# Altium schematic sheet GTM_PowerCircuits.SchDoc
size A4
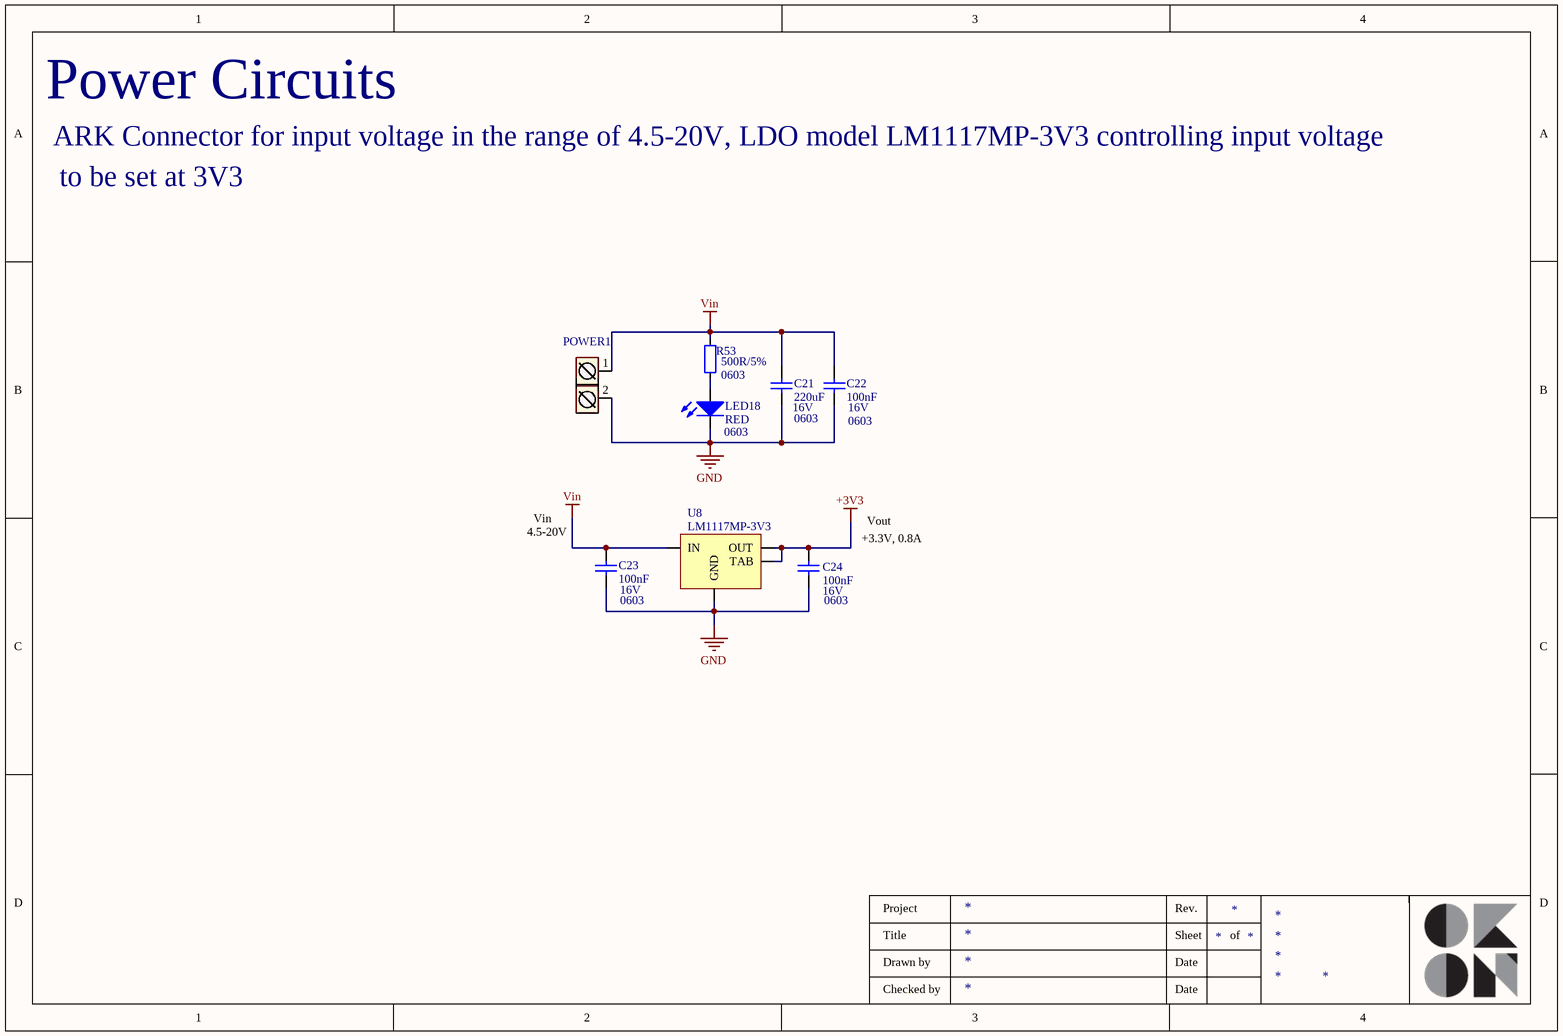
[diagram p0: GTM_PowerCircuits.SchDoc]

## Parts
C21  value 220uF  Package: 0603  Capacity: 16V  [0603_CAP]  (hidden comment: Cap)
C22  value 100nF  Package: 0603  Capacity: 16V  [0603_CAP]  (hidden comment: Cap)
C23  value 100nF  Package: 0603  Capacity: 16V  [0603_CAP]  (hidden comment: Cap)
C24  value 100nF  Package: 0603  Capacity: 16V  [0603_CAP]  (hidden comment: Cap)
LED18  RED  Package: 0603  [0603_led_red]
POWER1  ARK2  [ARK2]  (value not drawn)
R53  500R/5%  [0603]
U8  LM1117MP-3V3  [SOT223]

## Nets
+3V3: C24.1 U8.2(OUT) U8.4(TAB)
GND: C21.1 C22.1 C23.2 C24.2 LED18.2(K) POWER1.2 U8.1(GND)
Vin: C21.2 C22.2 C23.1 POWER1.1 R53.2 U8.3(IN)
NetLED18_1: LED18.1(A) R53.1

## Notes on the sheet
- Power Circuits
- ARK Connector for input voltage in the range of 4.5-20V, LDO model LM1117MP-3V3 controlling input voltage
- to be set at 3V3
- (near C23) 4.5-20V
- Vin
- +3.3V, 0.8A
- Vout
- Project
- Rev.
- Title
- Drawn by
- Date
- Sheet
- of
- Checked by

## Library data of the parts
C21-C24 = Cap: Ceramic capacitor; Unit Price1: *; Unit Price2: *
LED18 = LED: Light-emitting diode; COLOR: RED
POWER1 = ARK2: Złącze śrubowe 2 piny
R53 = RES: Resistior; Value: 500R/5%; Package: 0603
U8 = LM1117MP-3V3: 800mA Low-Dropout Linear Regulator; PartNumber: LM1117MP-3.3; Manufacturer: National Semiconductor; CompType: LDO IC; PackageTopMarking: XYTT*N05A; PowerWise: N; DatasheetVersion: Apr-2006; PackageVersion: revB, Apr-2003; PackageReference: MP04A; PackageDescription: Molded SOT-223, 6.50 x 3.56 x 1.6mm Body, 4 Lead, 2.3mm Pitch; ComponentLink1Description: LM1117 Datasheet; ComponentLink1URL: http://www.national.com/ds/LM/LM1117.pdf; ComponentLink2Description: LM1117 Web Page; ComponentLink2URL: http://www.national.com/pf/LM/LM1117.html; Published: 4-Dec-2008; Publisher: Altium Limited; RoHS: O; PinCount: 4; DigiKeyPartNumber: LM1117MP-3.3CT-ND; Code_JEDEC: TO-261-AA; Code_IPC: SOT223-4; ComponentLink3Description: MP04A Package Page; ComponentLink3URL: http://www.national.com/packaging/folders/mp04a.html